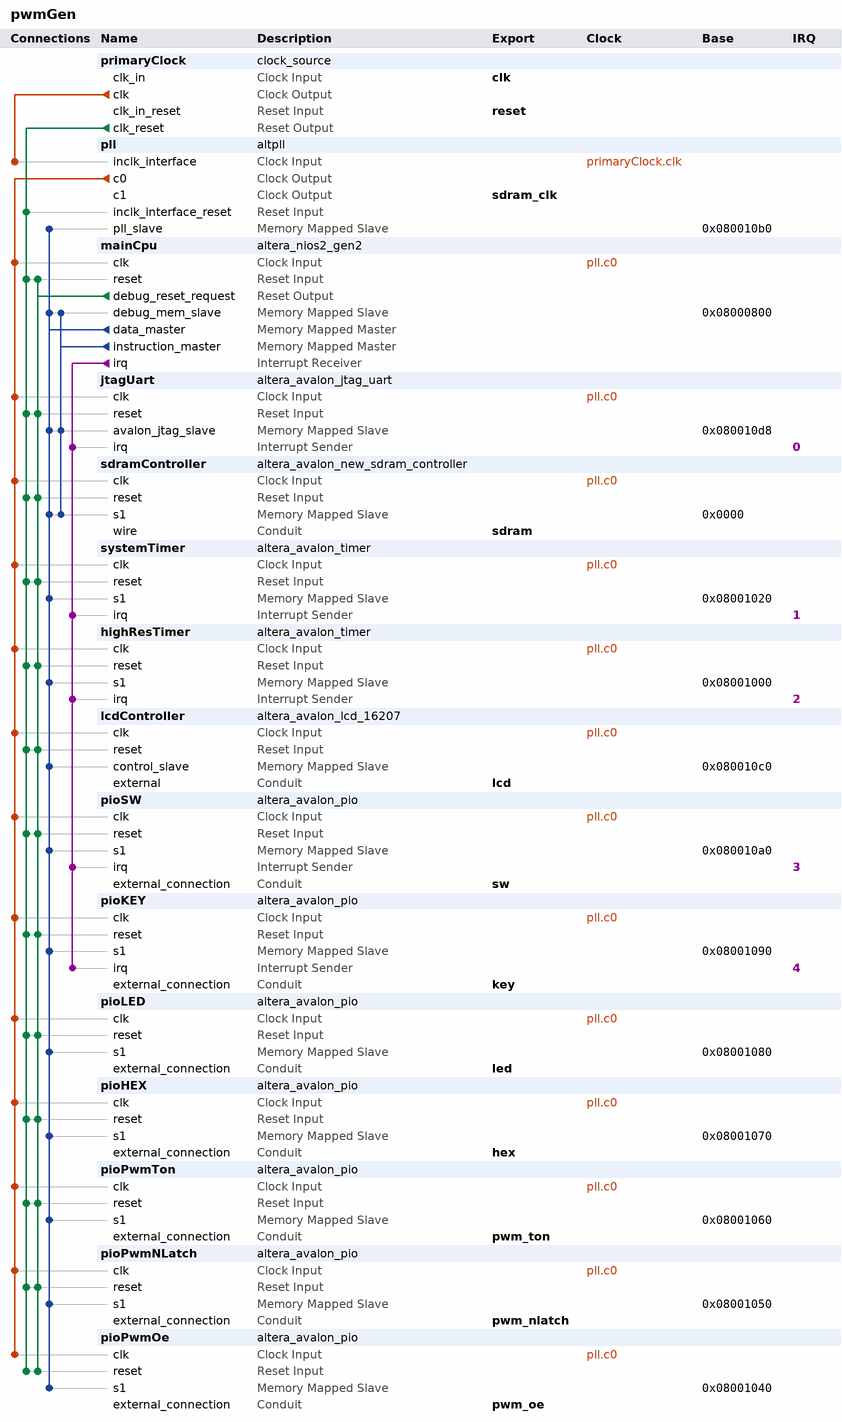
[diagram p0: system contents]
# Platform Designer (Qsys) system pwmGen, Cyclone IV E EP4CE115F29C7
# Parameters at their usual value, and those the tool derives, are not listed.
package require -exact qsys 20.1
create_system pwmGen
set_project_property DEVICE_FAMILY {Cyclone IV E}
set_project_property DEVICE EP4CE115F29C7

add_instance primaryClock clock_source 20.1
set_instance_parameter_value primaryClock clockFrequency 50000000

add_instance pll altpll 20.1
set_instance_parameter_value pll CLK0_DIVIDE_BY 1
set_instance_parameter_value pll CLK0_MULTIPLY_BY 2
set_instance_parameter_value pll CLK1_DIVIDE_BY 1
set_instance_parameter_value pll CLK1_DUTY_CYCLE 50
set_instance_parameter_value pll CLK1_MULTIPLY_BY 2
set_instance_parameter_value pll CLK1_PHASE_SHIFT -1667
set_instance_parameter_value pll INCLK0_INPUT_FREQUENCY 20000
set_instance_parameter_value pll PORT_ARESET PORT_UNUSED
set_instance_parameter_value pll PORT_LOCKED PORT_UNUSED
set_instance_parameter_value pll PORT_clk1 PORT_USED
set_instance_parameter_value pll PORT_clk2 PORT_UNUSED
set_instance_parameter_value pll PORT_clk3 PORT_UNUSED

add_instance mainCpu altera_nios2_gen2 20.1
set_instance_parameter_value mainCpu dcache_size 2048
set_instance_parameter_value mainCpu exceptionSlave sdramController.s1
set_instance_parameter_value mainCpu icache_size 4096
set_instance_parameter_value mainCpu impl Tiny
set_instance_parameter_value mainCpu resetSlave sdramController.s1

add_instance jtagUart altera_avalon_jtag_uart 20.1
set_instance_parameter_value jtagUart simInteractiveOptions NO_INTERACTIVE_WINDOWS

add_instance sdramController altera_avalon_new_sdram_controller 20.1
set_instance_parameter_value sdramController TAC 5.5
set_instance_parameter_value sdramController TRCD 20.0
set_instance_parameter_value sdramController TRP 20.0
set_instance_parameter_value sdramController casLatency 3
set_instance_parameter_value sdramController columnWidth 10
set_instance_parameter_value sdramController dataWidth 32
set_instance_parameter_value sdramController generateSimulationModel false
set_instance_parameter_value sdramController model single_Micron_MT48LC4M32B2_7_chip
set_instance_parameter_value sdramController numberOfBanks 4
set_instance_parameter_value sdramController numberOfChipSelects 1
set_instance_parameter_value sdramController powerUpDelay 200.0
set_instance_parameter_value sdramController refreshPeriod 7.8125
set_instance_parameter_value sdramController rowWidth 13

add_instance systemTimer altera_avalon_timer 20.1
set_instance_parameter_value systemTimer period 1
set_instance_parameter_value systemTimer periodUnits MSEC

add_instance highResTimer altera_avalon_timer 20.1
set_instance_parameter_value highResTimer period 1
set_instance_parameter_value highResTimer periodUnits USEC

add_instance lcdController altera_avalon_lcd_16207 20.1

add_instance pioSW altera_avalon_pio 20.1
set_instance_parameter_value pioSW captureEdge true
set_instance_parameter_value pioSW direction Input
set_instance_parameter_value pioSW edgeType ANY
set_instance_parameter_value pioSW generateIRQ true
set_instance_parameter_value pioSW width 13

add_instance pioKEY altera_avalon_pio 20.1
set_instance_parameter_value pioKEY captureEdge true
set_instance_parameter_value pioKEY direction Input
set_instance_parameter_value pioKEY edgeType FALLING
set_instance_parameter_value pioKEY generateIRQ true
set_instance_parameter_value pioKEY width 4

add_instance pioLED altera_avalon_pio 20.1
set_instance_parameter_value pioLED direction Output
set_instance_parameter_value pioLED width 13

add_instance pioHEX altera_avalon_pio 20.1
set_instance_parameter_value pioHEX direction Output
set_instance_parameter_value pioHEX width 32

add_instance pioPwmTon altera_avalon_pio 20.1
set_instance_parameter_value pioPwmTon direction Output
set_instance_parameter_value pioPwmTon width 10

add_instance pioPwmNLatch altera_avalon_pio 20.1
set_instance_parameter_value pioPwmNLatch direction Output
set_instance_parameter_value pioPwmNLatch resetValue 16777215
set_instance_parameter_value pioPwmNLatch width 24

add_instance pioPwmOe altera_avalon_pio 20.1
set_instance_parameter_value pioPwmOe direction Output
set_instance_parameter_value pioPwmOe width 24

# connections
add_connection pll.c0 highResTimer.clk clock
add_connection pll.c0 jtagUart.clk clock
add_connection pll.c0 lcdController.clk clock
add_connection pll.c0 mainCpu.clk clock
add_connection pll.c0 pioHEX.clk clock
add_connection pll.c0 pioKEY.clk clock
add_connection pll.c0 pioLED.clk clock
add_connection pll.c0 pioPwmNLatch.clk clock
add_connection pll.c0 pioPwmOe.clk clock
add_connection pll.c0 pioPwmTon.clk clock
add_connection pll.c0 pioSW.clk clock
add_connection pll.c0 sdramController.clk clock
add_connection pll.c0 systemTimer.clk clock
add_connection primaryClock.clk pll.inclk_interface clock
add_connection mainCpu.debug_reset_request highResTimer.reset reset
add_connection mainCpu.debug_reset_request jtagUart.reset reset
add_connection mainCpu.debug_reset_request lcdController.reset reset
add_connection mainCpu.debug_reset_request mainCpu.reset reset
add_connection mainCpu.debug_reset_request pioHEX.reset reset
add_connection mainCpu.debug_reset_request pioKEY.reset reset
add_connection mainCpu.debug_reset_request pioLED.reset reset
add_connection mainCpu.debug_reset_request pioPwmNLatch.reset reset
add_connection mainCpu.debug_reset_request pioPwmOe.reset reset
add_connection mainCpu.debug_reset_request pioPwmTon.reset reset
add_connection mainCpu.debug_reset_request pioSW.reset reset
add_connection mainCpu.debug_reset_request sdramController.reset reset
add_connection mainCpu.debug_reset_request systemTimer.reset reset
add_connection primaryClock.clk_reset highResTimer.reset reset
add_connection primaryClock.clk_reset jtagUart.reset reset
add_connection primaryClock.clk_reset lcdController.reset reset
add_connection primaryClock.clk_reset mainCpu.reset reset
add_connection primaryClock.clk_reset pioHEX.reset reset
add_connection primaryClock.clk_reset pioKEY.reset reset
add_connection primaryClock.clk_reset pioLED.reset reset
add_connection primaryClock.clk_reset pioPwmNLatch.reset reset
add_connection primaryClock.clk_reset pioPwmOe.reset reset
add_connection primaryClock.clk_reset pioPwmTon.reset reset
add_connection primaryClock.clk_reset pioSW.reset reset
add_connection primaryClock.clk_reset pll.inclk_interface_reset reset
add_connection primaryClock.clk_reset sdramController.reset reset
add_connection primaryClock.clk_reset systemTimer.reset reset
add_connection mainCpu.data_master highResTimer.s1 avalon
set_connection_parameter_value mainCpu.data_master/highResTimer.s1 baseAddress 0x08001000
add_connection mainCpu.data_master jtagUart.avalon_jtag_slave avalon
set_connection_parameter_value mainCpu.data_master/jtagUart.avalon_jtag_slave baseAddress 0x080010d8
add_connection mainCpu.data_master lcdController.control_slave avalon
set_connection_parameter_value mainCpu.data_master/lcdController.control_slave baseAddress 0x080010c0
add_connection mainCpu.data_master mainCpu.debug_mem_slave avalon
set_connection_parameter_value mainCpu.data_master/mainCpu.debug_mem_slave baseAddress 0x08000800
add_connection mainCpu.data_master pioHEX.s1 avalon
set_connection_parameter_value mainCpu.data_master/pioHEX.s1 baseAddress 0x08001070
add_connection mainCpu.data_master pioKEY.s1 avalon
set_connection_parameter_value mainCpu.data_master/pioKEY.s1 baseAddress 0x08001090
add_connection mainCpu.data_master pioLED.s1 avalon
set_connection_parameter_value mainCpu.data_master/pioLED.s1 baseAddress 0x08001080
add_connection mainCpu.data_master pioPwmNLatch.s1 avalon
set_connection_parameter_value mainCpu.data_master/pioPwmNLatch.s1 baseAddress 0x08001050
add_connection mainCpu.data_master pioPwmOe.s1 avalon
set_connection_parameter_value mainCpu.data_master/pioPwmOe.s1 baseAddress 0x08001040
add_connection mainCpu.data_master pioPwmTon.s1 avalon
set_connection_parameter_value mainCpu.data_master/pioPwmTon.s1 baseAddress 0x08001060
add_connection mainCpu.data_master pioSW.s1 avalon
set_connection_parameter_value mainCpu.data_master/pioSW.s1 baseAddress 0x080010a0
add_connection mainCpu.data_master pll.pll_slave avalon
set_connection_parameter_value mainCpu.data_master/pll.pll_slave baseAddress 0x080010b0
add_connection mainCpu.data_master sdramController.s1 avalon
set_connection_parameter_value mainCpu.data_master/sdramController.s1 baseAddress 0x0000
add_connection mainCpu.data_master systemTimer.s1 avalon
set_connection_parameter_value mainCpu.data_master/systemTimer.s1 baseAddress 0x08001020
add_connection mainCpu.instruction_master jtagUart.avalon_jtag_slave avalon
set_connection_parameter_value mainCpu.instruction_master/jtagUart.avalon_jtag_slave baseAddress 0x080010d8
add_connection mainCpu.instruction_master mainCpu.debug_mem_slave avalon
set_connection_parameter_value mainCpu.instruction_master/mainCpu.debug_mem_slave baseAddress 0x08000800
add_connection mainCpu.instruction_master sdramController.s1 avalon
set_connection_parameter_value mainCpu.instruction_master/sdramController.s1 baseAddress 0x0000
add_connection mainCpu.irq highResTimer.irq interrupt
set_connection_parameter_value mainCpu.irq/highResTimer.irq irqNumber 2
add_connection mainCpu.irq jtagUart.irq interrupt
set_connection_parameter_value mainCpu.irq/jtagUart.irq irqNumber 0
add_connection mainCpu.irq pioKEY.irq interrupt
set_connection_parameter_value mainCpu.irq/pioKEY.irq irqNumber 4
add_connection mainCpu.irq pioSW.irq interrupt
set_connection_parameter_value mainCpu.irq/pioSW.irq irqNumber 3
add_connection mainCpu.irq systemTimer.irq interrupt
set_connection_parameter_value mainCpu.irq/systemTimer.irq irqNumber 1

# exported interfaces
add_interface clk clock sink
set_interface_property clk EXPORT_OF primaryClock.clk_in
add_interface hex conduit end
set_interface_property hex EXPORT_OF pioHEX.external_connection
add_interface key conduit end
set_interface_property key EXPORT_OF pioKEY.external_connection
add_interface lcd conduit end
set_interface_property lcd EXPORT_OF lcdController.external
add_interface led conduit end
set_interface_property led EXPORT_OF pioLED.external_connection
add_interface pwm_nlatch conduit end
set_interface_property pwm_nlatch EXPORT_OF pioPwmNLatch.external_connection
add_interface pwm_oe conduit end
set_interface_property pwm_oe EXPORT_OF pioPwmOe.external_connection
add_interface pwm_ton conduit end
set_interface_property pwm_ton EXPORT_OF pioPwmTon.external_connection
add_interface reset reset sink
set_interface_property reset EXPORT_OF primaryClock.clk_in_reset
add_interface sdram conduit end
set_interface_property sdram EXPORT_OF sdramController.wire
add_interface sdram_clk clock source
set_interface_property sdram_clk EXPORT_OF pll.c1
add_interface sw conduit end
set_interface_property sw EXPORT_OF pioSW.external_connection

set_interconnect_requirement {$system} qsys_mm.clockCrossingAdapter HANDSHAKE
set_interconnect_requirement {$system} qsys_mm.enableEccProtection FALSE
set_interconnect_requirement {$system} qsys_mm.insertDefaultSlave FALSE
set_interconnect_requirement {$system} qsys_mm.maxAdditionalLatency 1

save_system pwmGen.qsys
